# EAGLE design product (EAGLE 7.7.0)

## Sheet 1 of 4: MCU
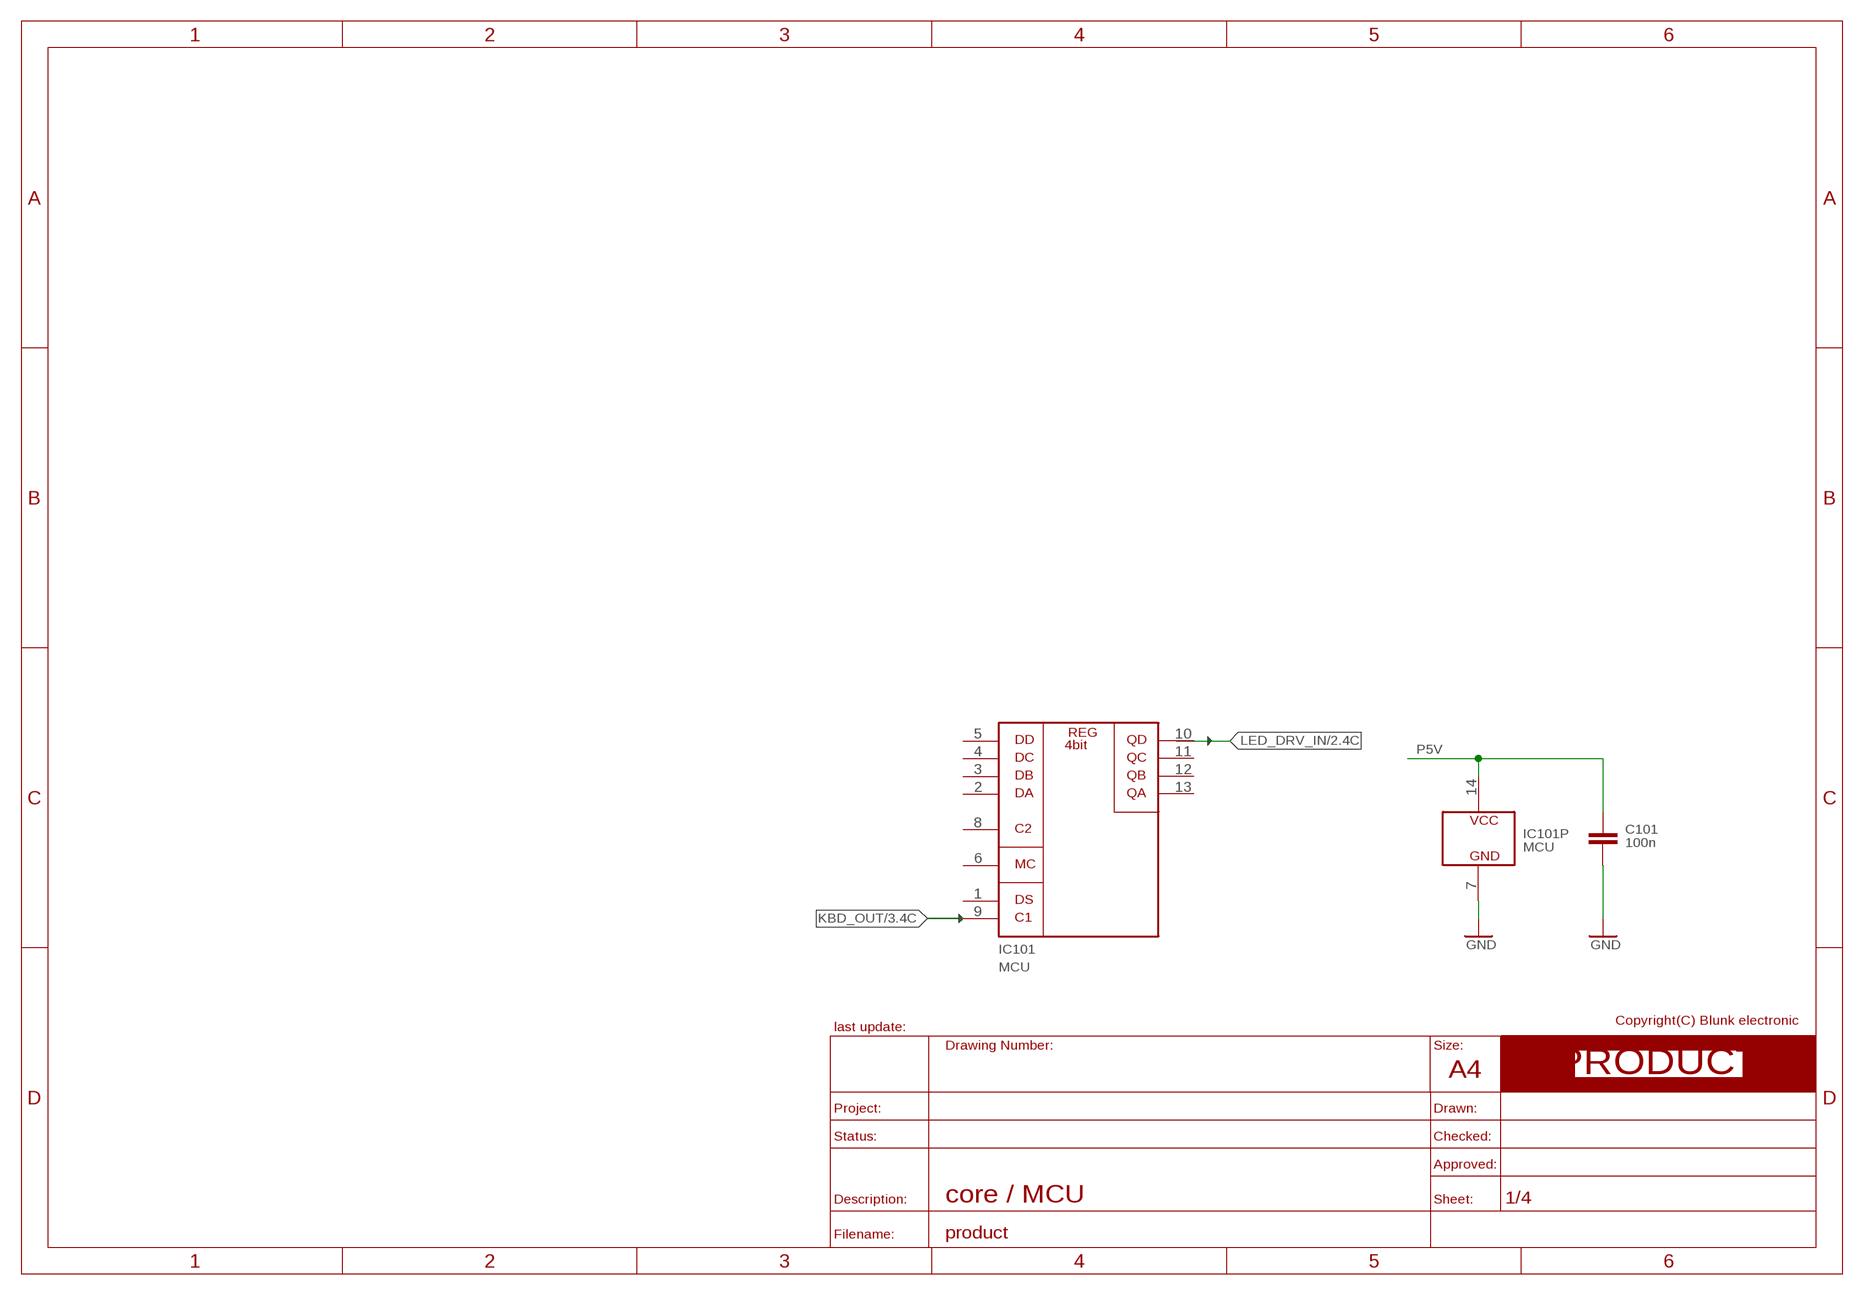
[diagram p0: schematic, sheet 1]
FRAME_PRODUCT1 (A4_LANDSCAPE_PRODUCT): BOM: NO; COMMISSIONED: 2013-08-30; DESCRIPTION: core / MCU
U$3 (ARROW_1): BOM: NO; COMMISSIONED: 2013-08-30
U$4 (ARROW_1): BOM: NO; COMMISSIONED: 2013-08-30

### Parts
C101  100n  C_S_0805  [S_0805]
IC101  MCU  7495D  [S_SO14]

### Nets
GND: C101.2 IC101.7(GND) ; also sheet 2,3,4
KBD_OUT: IC101.9(C1) ; also sheet 3
LED_DRV_IN: IC101.10(QD) ; also sheet 2
P5V: C101.1 IC101.14(VCC) ; also sheet 2,3,4
Unconnected: IC101.1(DS) IC101.2(DA) IC101.3(DB) IC101.4(DC) IC101.5(DD) IC101.6(MC) IC101.8(C2) IC101.11(QC) IC101.12(QB) IC101.13(QA)

## Sheet 2 of 4: led driver
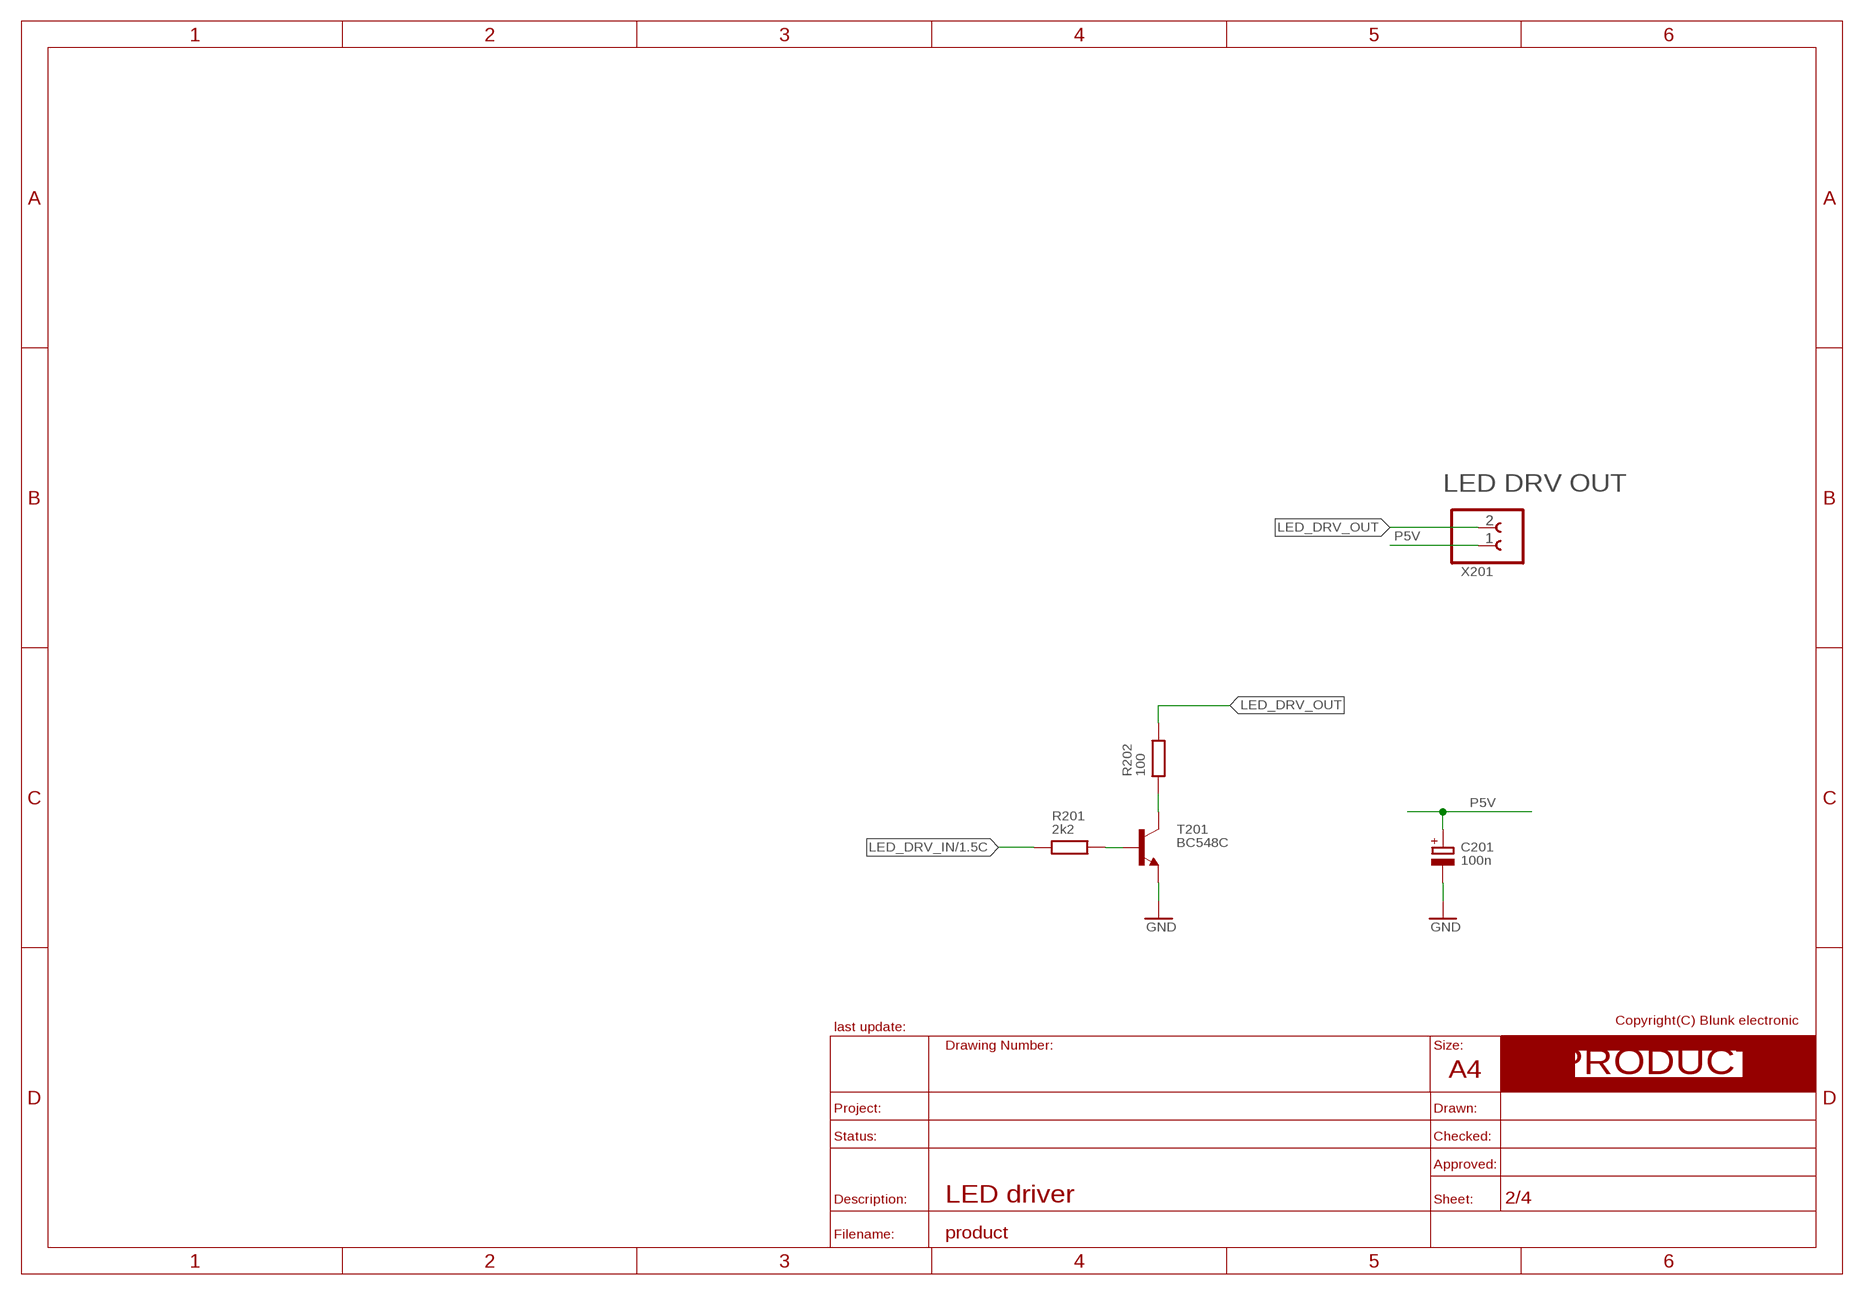
[diagram p1: schematic, sheet 2]
FRAME_PRODUCT2 (A4_LANDSCAPE_PRODUCT): BOM: NO; COMMISSIONED: 2013-08-30; DESCRIPTION: LED driver

### Parts
C201  100n  C_POL_S_6032  [S_6032]
R201  2k2  R_S_0805  [S_0805]
R202  100  R_S_0805  [S_0805]
T201  BC548C  NPN_S_SOT23  [S_SOT23]
X201  CLAMP_1X2-T-2.5MM  [T_WIRE_CLAMP_1X2_PITCH_2MM5]

### Nets
GND: C201.- T201.2(E) ; also sheet 1,3,4
LED_DRV_B: R201.2 T201.1(B)
LED_DRV_C: R202.1 T201.3(C)
LED_DRV_IN: R201.1 ; also sheet 1
LED_DRV_OUT: R202.2 X201.2
P5V: C201.+ X201.1 ; also sheet 1,3,4

## Sheet 3 of 4: push button
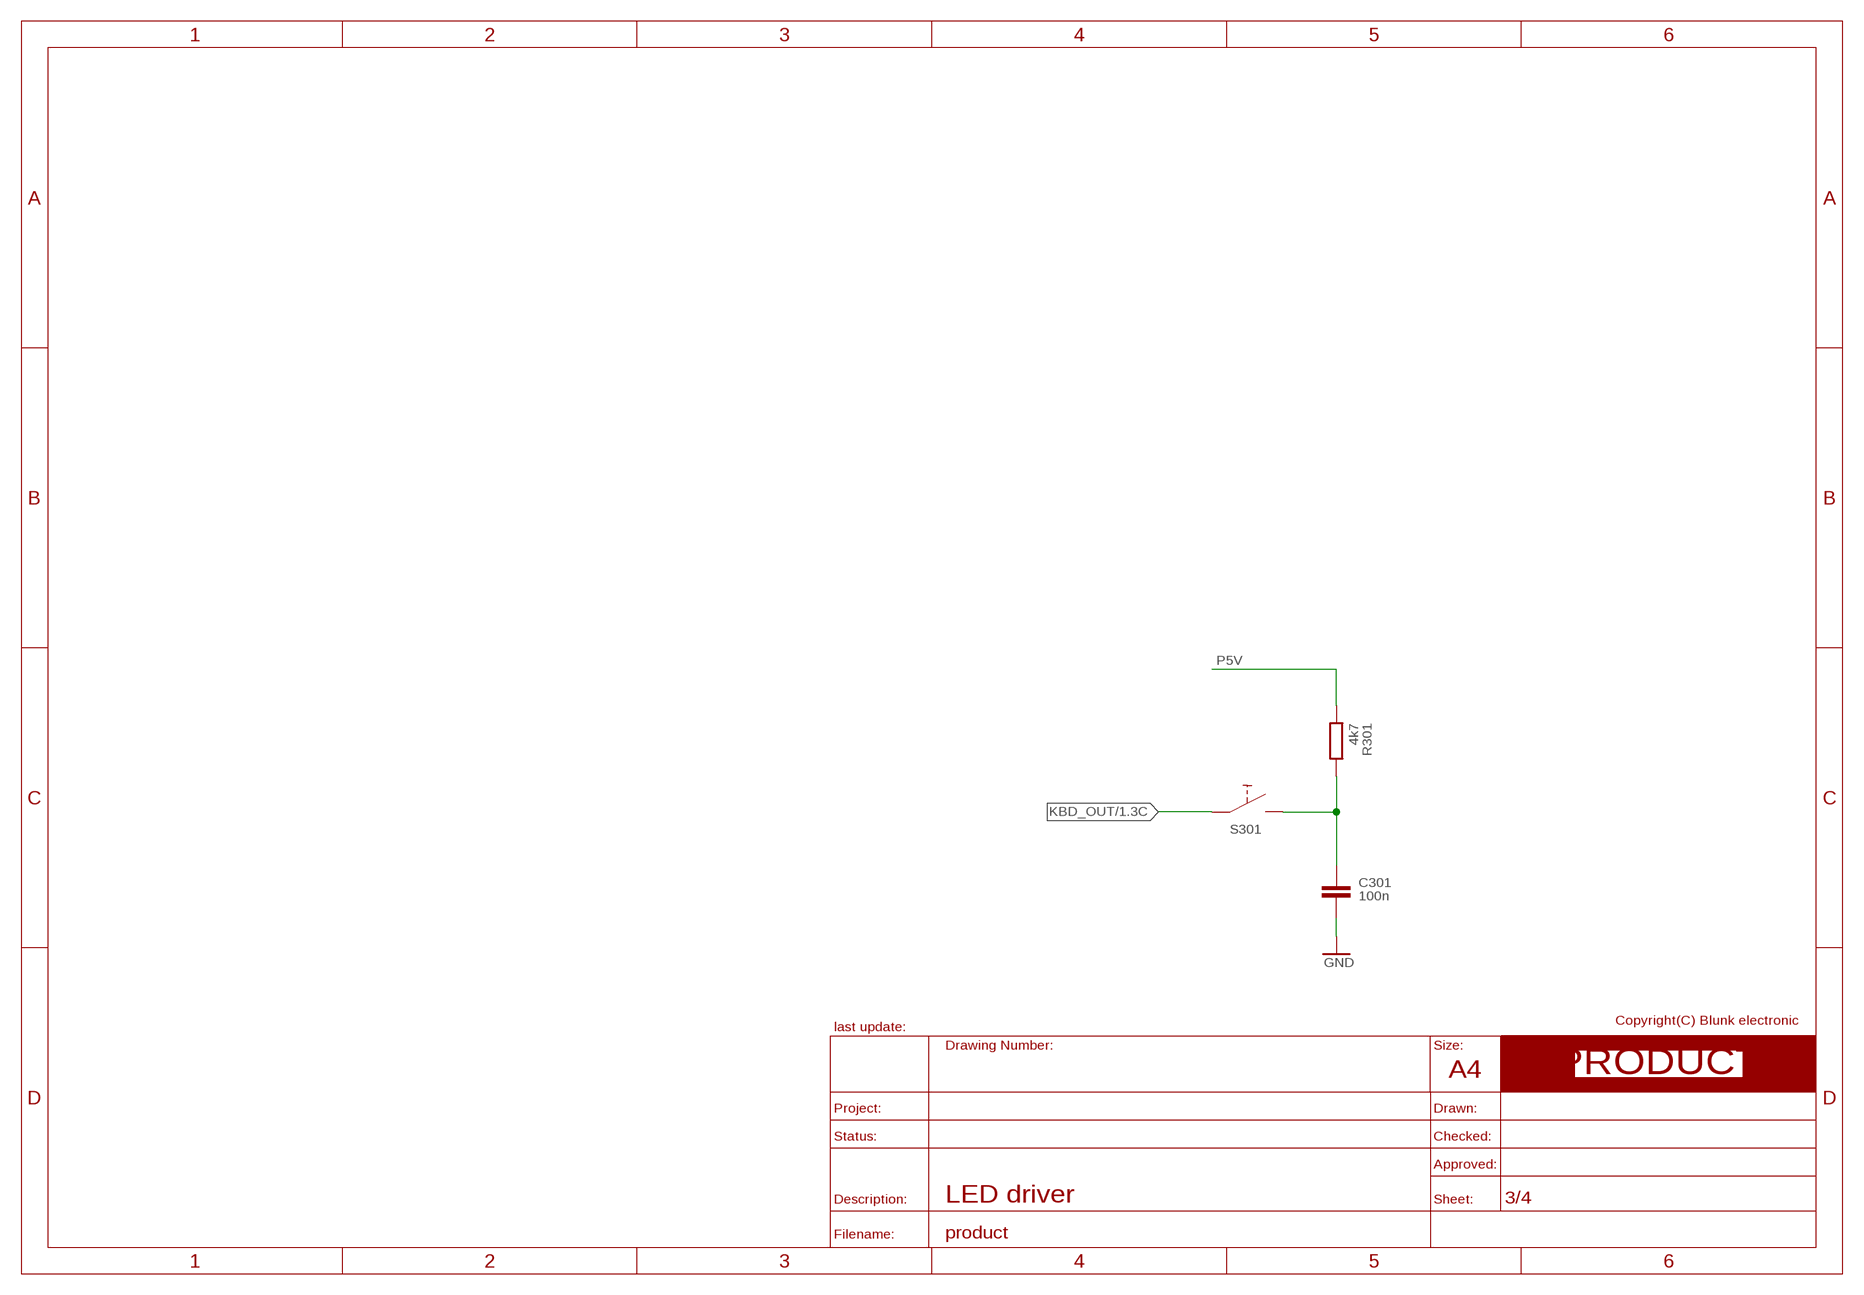
[diagram p2: schematic, sheet 3]
FRAME_PRODUCT3 (A4_LANDSCAPE_PRODUCT): BOM: NO; COMMISSIONED: 2013-08-30; DESCRIPTION: LED driver

### Parts
C301  100n  C_S_0805  [S_0805]
R301  4k7  R_S_0805  [S_0805]
S301  PUSH_BUTTON_S_6X6MM  [S_PUSH_BUTTON_6X6]

### Nets
GND: C301.2 ; also sheet 1,2,4
KBD_OUT: S301.A1 S301.A(A1) ; also sheet 1
KBD_RC: C301.1 R301.2 S301.B1 S301.B(B1)
P5V: R301.1 ; also sheet 1,2,4

## Sheet 4 of 4: PWR supply
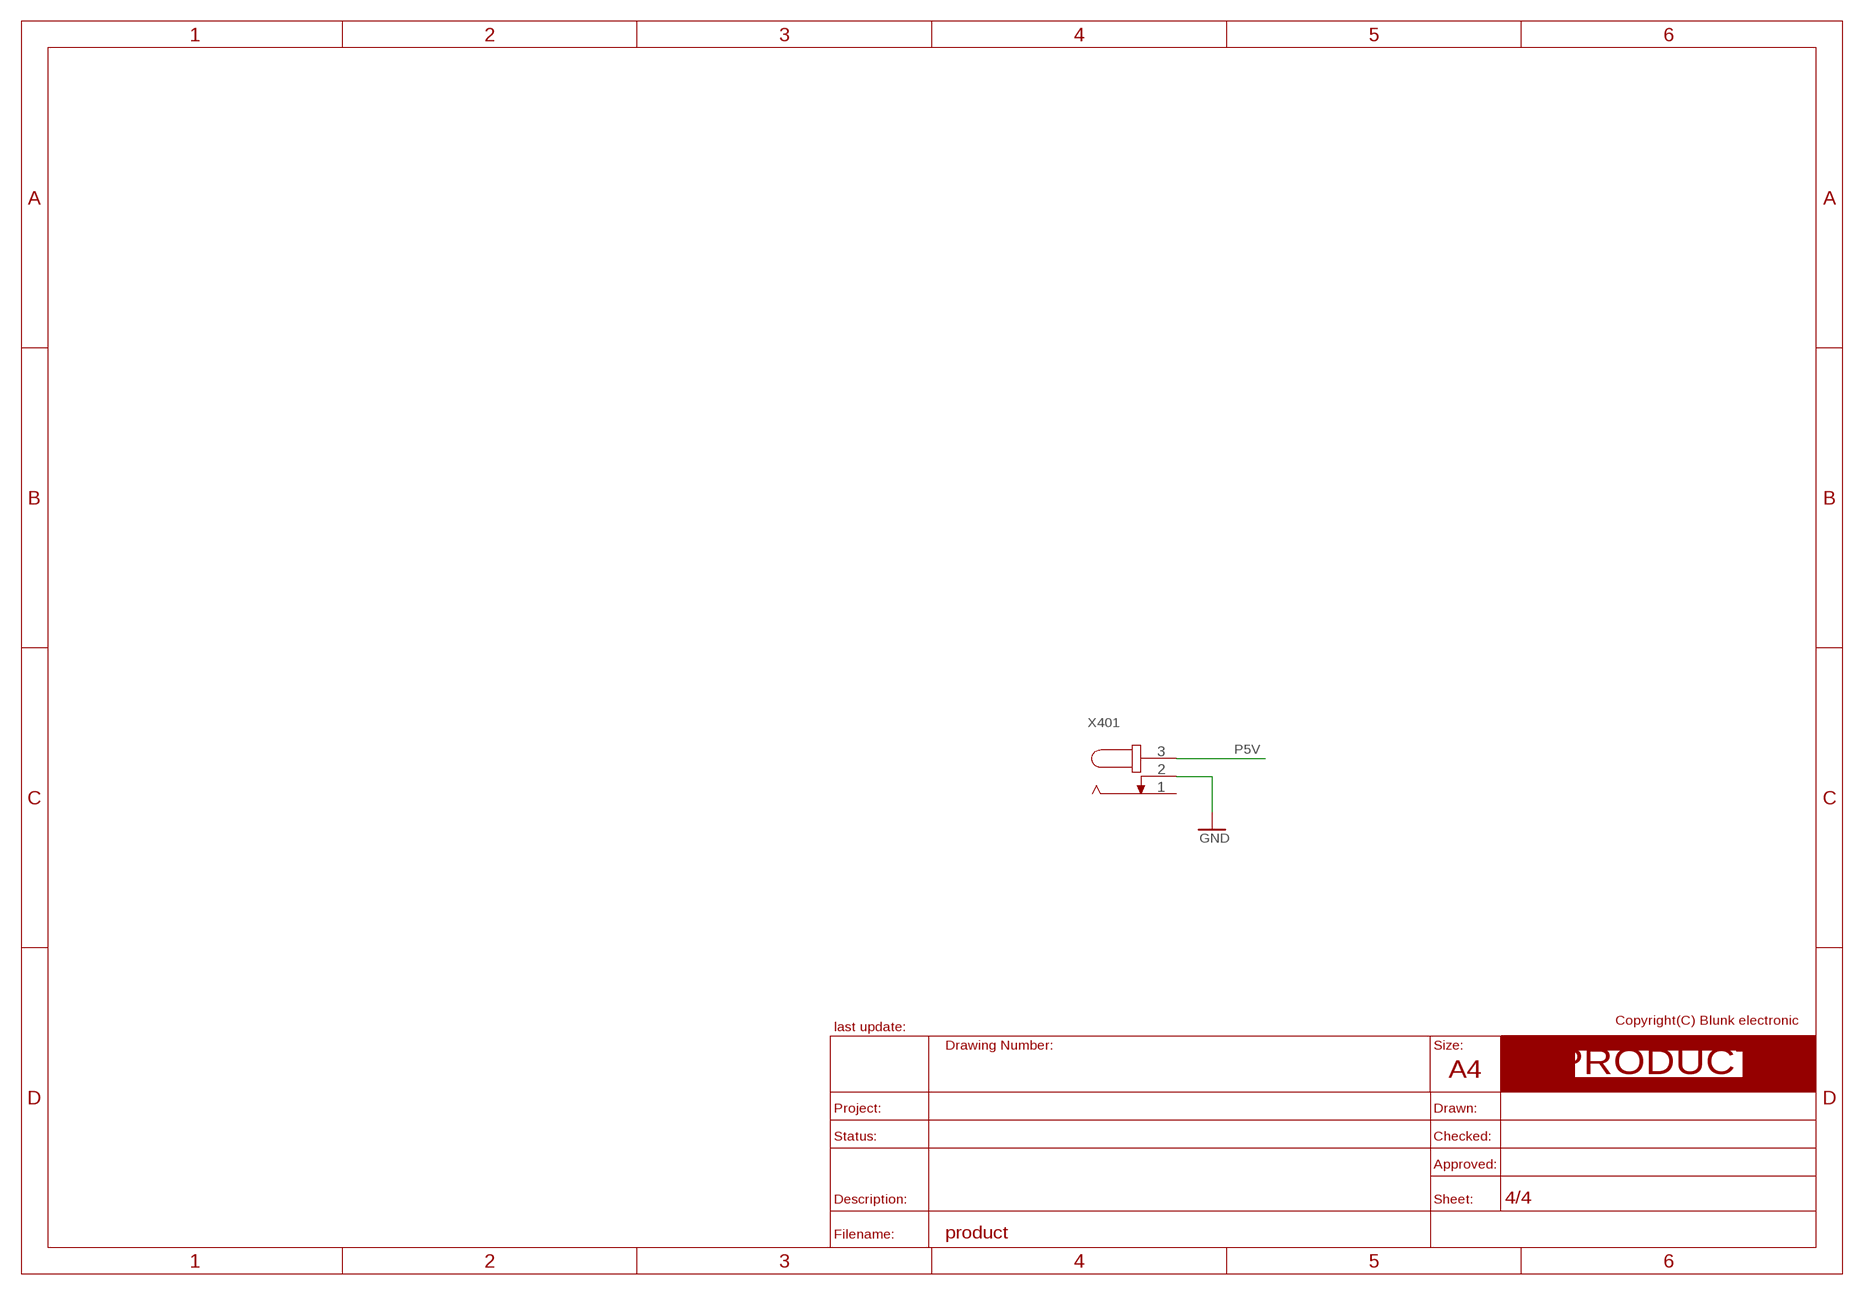
[diagram p3: schematic, sheet 4]
FRAME_PRODUCT4 (A4_LANDSCAPE_PRODUCT): BOM: NO; COMMISSIONED: 2013-08-30

### Parts
X401  POWER_JACK-T-0  [T_POWER_JACK_SPC4077]

### Nets
GND: X401.2 ; also sheet 1,2,3
P5V: X401.3 ; also sheet 1,2,3
Unconnected: X401.1

## Library data of the parts
C101 C301 = be_rcl:C: drawn: Mario Blunk / Blunk electronic; BOM: YES; COMMISSIONED: 2013-08-30; PART_CODE_BEL: C_PAC_S_0805_VAL_
C201 = be_rcl:C_POL: edited: Mario Blunk / Blunk electronic; BOM: YES; COMMISSIONED: 2013-08-30; PART_CODE_BEL: C_PAC_S_6032_VAL_
IC101 = be_logic:74*95: edited: Mario Blunk / Blunk electronic
R201 R202 R301 = be_rcl:R: edited: Mario Blunk / Blunk electronic; BOM: YES; COMMISSIONED: 2013-08-30; PART_CODE_BEL: R_PAC_S_0805_VAL_
S301 = be_switch:PUSH_BUTTON: edited: Mario Blunk; BOM: YES; COMMISSIONED: 2013-08-30; PART_CODE_BEL: S_PAC_S_PUSH_BUTTON_6X6mm
T201 = be_transistor:NPN: edited: Mario Blunk; BOM: YES; COMMISSIONED: 2013-08-30; PART_CODE_BEL: T_PAC_S_SOT23_VAL_
X201 = be_con_jump:CLAMP_1X2: drawn: Mario Blunk / Blunk electronic; BOM: YES; COMMISSIONED: 2014-04-14; FUNCTION: LED DRV OUT; PART_CODE_BEL: X_PAC_T_CLAMP_1X2_PITCH_2mm5
X401 = be_con_jump:POWER_JACK: DC POWER JACK Power Jack, DC, Right Angle, Through Hole, Rated 5A at 16VDC, PC Terminals Distributor: Farnell (www.Farnell.de) Drawing: 84N1161.pdf / 84N1162.pdf Manufacturer: SPC Technology (www.spctechnology.com) Type: SPC4077 / SPC 4078 edited: Mario Blunk / Blunk electronic date: 2013-03-21; BOM: YES; COMMISSIONED: 2013-08-30; PART_CODE_BEL: X_PAC_T_POWER_JACK_SPC4077

## Board
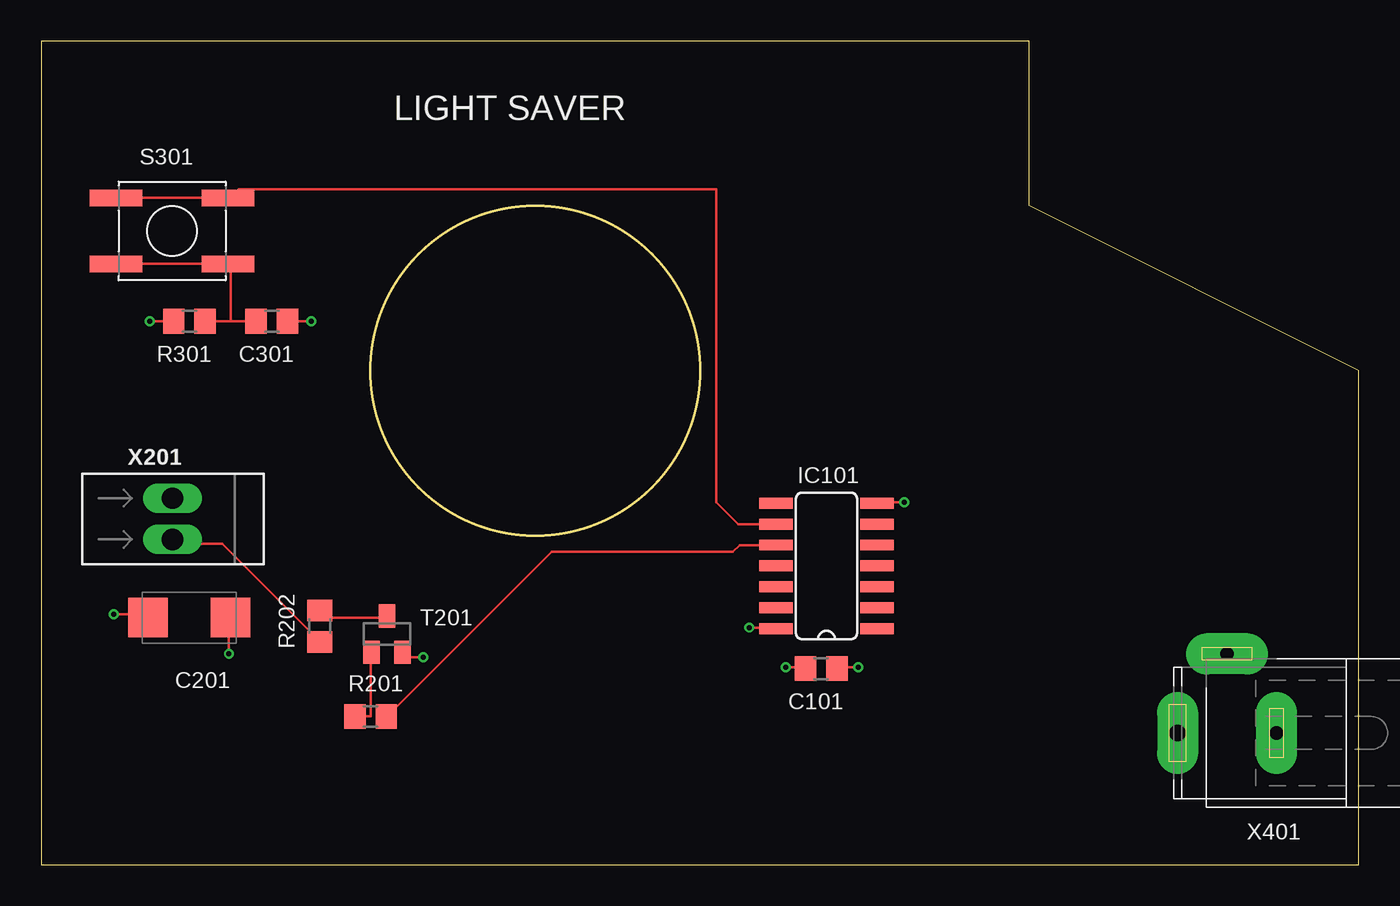
[diagram p4: board, top side]
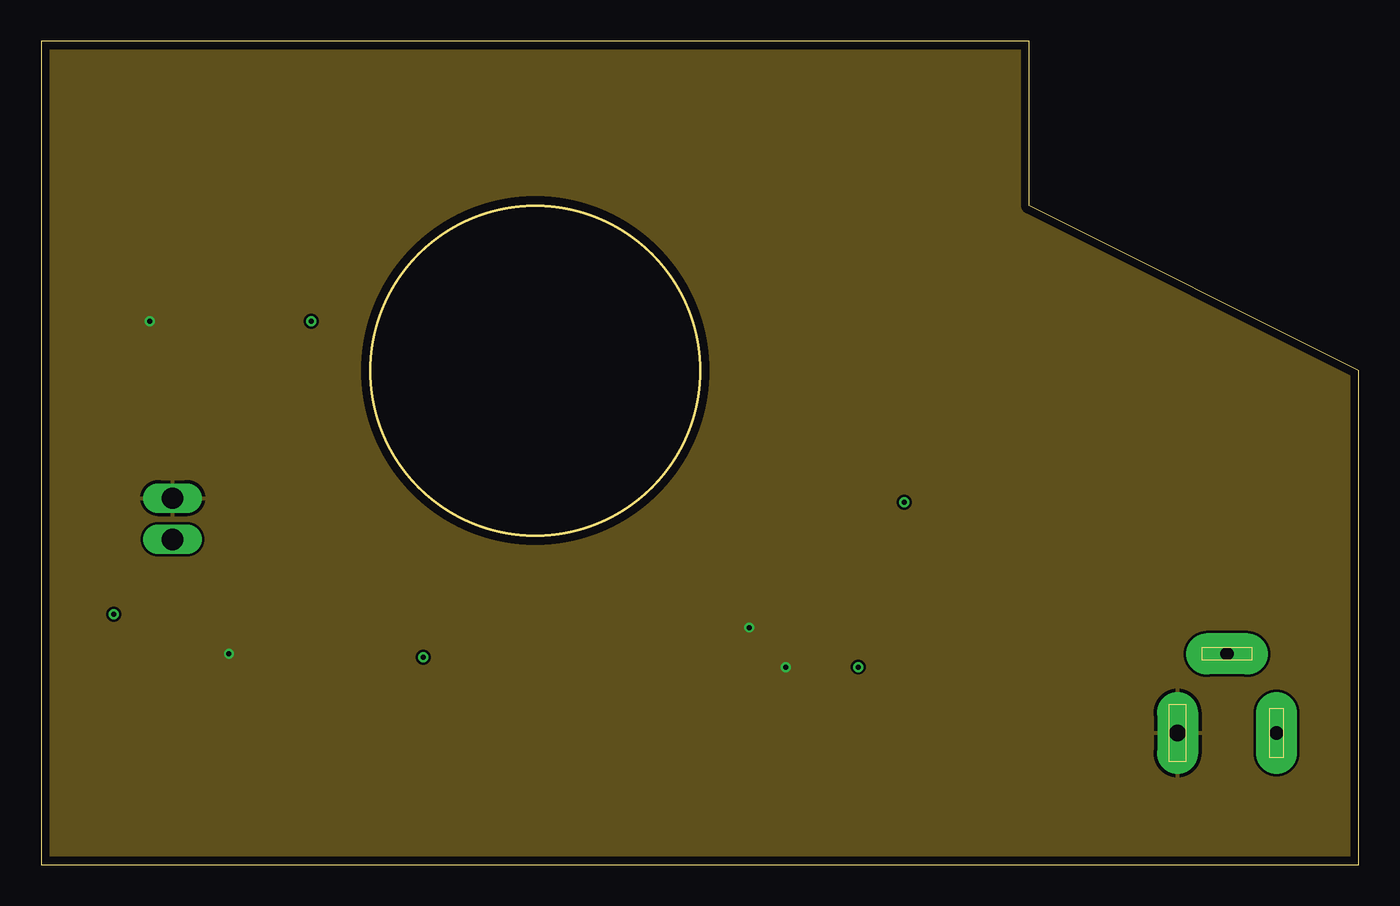
[diagram p5: board, inner layer Route2]
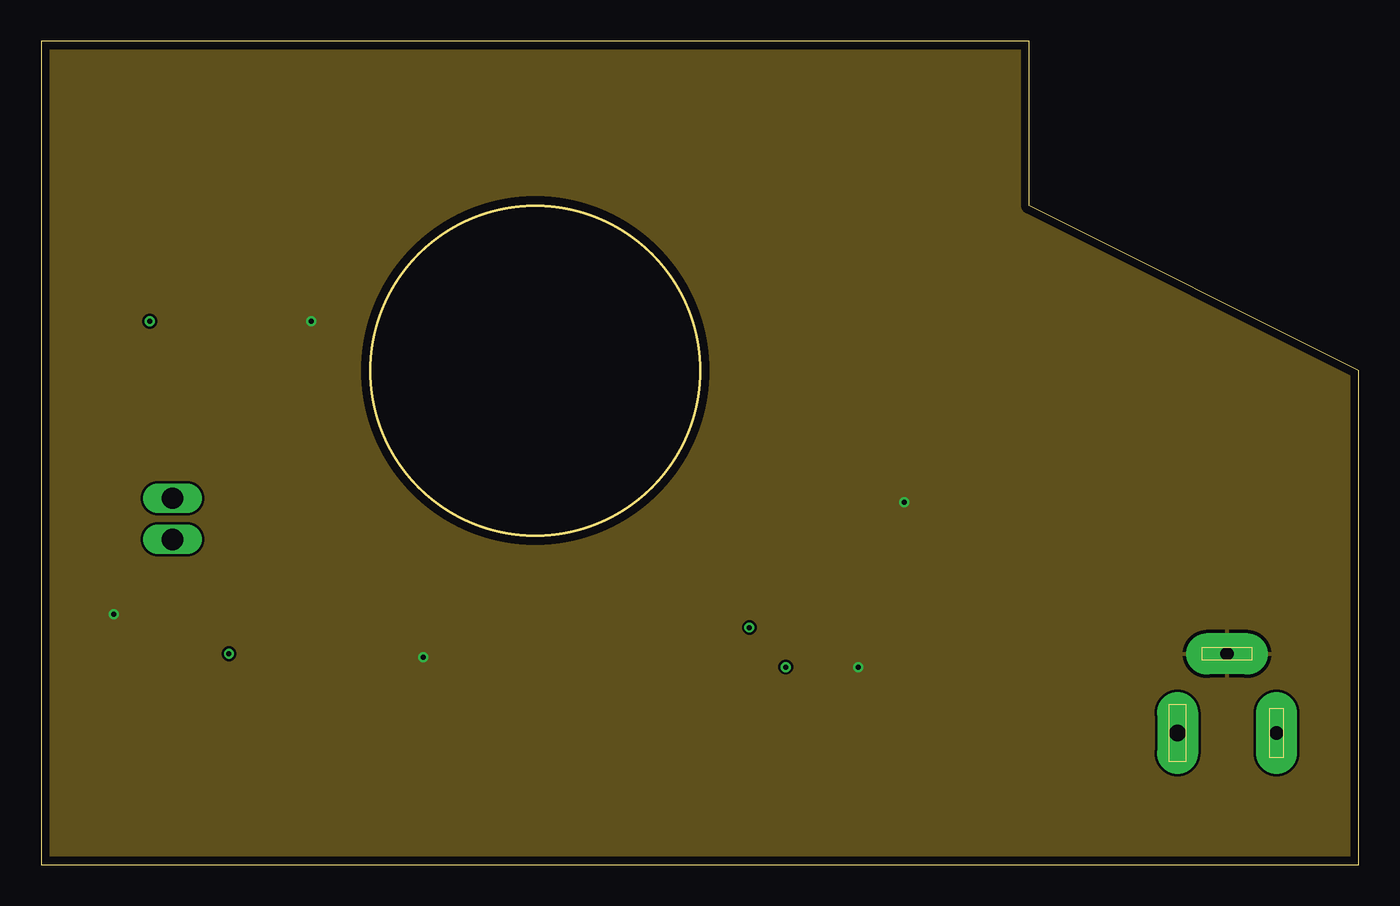
[diagram p6: board, inner layer Route15]

Size 80 x 50 mm. Coordinates in mm from the lower left corner, seen from the top.
Outline: 0,0 80,0 80,30 60,40 60,50 0,50 0,0
Outline: circle at 30,30 radius 10
Copper layers (1+2*15+16): Top 0.018mm / dielectric 0.37mm / Route2 0.035mm / dielectric 0.65mm / Route15 0.035mm / dielectric 0.37mm / Bottom 0.018mm
Design rules "JLP_ML4_std": minimum track width 0.15mm, minimum drill 0.3mm, track to track 0.15mm, track to pad 0.15mm, pad to pad 0.15mm, via to via 0.15mm, smd to smd 0.15mm, copper to edge 0.5mm, drill to drill 0.2mm, minimum pad ring 0.15mm, minimum via ring 0.15mm, stop-mask expansion 0.075mm, vias tented up to drill 0.3mm, thermal gap 0.2mm

### Footprints (pad centres in the part's own frame; a part is rotated, then mirrored left to right if it is on the bottom)
S_0805 = smd 1.3 x 1.5: 1 -0.95,0; 2 0.95,0
S_6032 = smd 2.4 x 2.4: + -2.5,0; - 2.5,0
S_SO14 = smd 0.66 x 2.032: 1 -3.81,-3.073; 2 -2.54,-3.073; 3 -1.27,-3.073; 4 0,-3.073; 5 1.27,-3.073; 6 2.54,-3.073; 7 3.81,-3.073; 8 3.81,3.073; 9 2.54,3.073; 10 1.27,3.073; 11 0,3.073; 12 -1.27,3.073; 13 -2.54,3.073; 14 -3.81,3.073
S_PUSH_BUTTON_6X6 = smd 3.2 x 1: A -3.4,2; A1 3.4,2; B -3.4,-2; B1 3.4,-2
S_SOT23 = smd 1 x 1.4: 1 -0.95,-1.1; 2 0.95,-1.1; 3 0,1.1
T_WIRE_CLAMP_1X2_PITCH_2MM5 = drill 1.3 pad 1.8 long: 1 -1.25,-0.02; 2 1.25,-0.02
T_POWER_JACK_SPC4077 = drill 0.8 pad 2.5 long: 1 -3,0; 2 0,-4.8 | drill 1 pad 2.5 long: 3 3,0

### Placement (x,y rotation side)
C101  47.36,11.91 0 top
C201  9,15 180 top
C301  14,33 0 top
IC101  47.68,18.14 90 top
R201  20,9 180 top
R202  16.91,14.48 270 top
R301  9,33 0 top
S301  7.95,38.48 0 top
T201  21,14 0 top
X201  8,21 270 top
X401  72,8 180 top

### Tracks (layer width: path | path; a pad name or v marks a point on that pad's centre or on a via)
GND  (via drill 0.3)
  Top 0.15: C101.2 48.4,12 v49.6,12 | C201.- 6.3,15.2 v4.4,15.2 | T201.2 22.25,12.6 v23.2,12.6 | C301.2 v16.4,33 | IC101.7 50.8,22 v52.4,22
  pour Route15: 0,50 80,50 80,0 0,0
KBD_OUT
  Top 0.15: S301.A 5,40.5 11,40.5 S301.A1 11.5,40.5 12,41 41,41 41,22 42.32,20.68 IC101.9
KBD_RC
  Top 0.15: C301.1 11.5,33 | 11.5,33 R301.2 | 11.5,33 11.5,36 S301.B1 11,36.5 5,36.5 S301.B
LED_DRV_B
  Top 0.15: R201.2 20,9 20,12.5 T201.1
LED_DRV_C
  Top 0.15: T201.3 21,15 17,15 R202.1
LED_DRV_IN
  Top 0.15: R201.1 21,9 31,19 42,19 42.41,19.41 IC101.10
LED_DRV_OUT
  Top 0.15: R202.2 16.5,14 11,19.5 8,19.5 X201.2
P5V  (via drill 0.3)
  Top 0.15: C101.1 46.32,12 v45.2,12 | R301.1 v6.6,33 | C201.+ 11.4,14.9 v11.4,12.8 | IC101.14 44.54,14.4 v43,14.4
  pour Route2: 0,50 80,50 80,0 0,0

### Text on the board
tPlace: LIGHT SAVER